# EasyEDA Pro project 3.3toTTL.eprj

# Schematic Schematic1
Create Date: 2022-09-10; Page Name: 3.3-5; Project Name: temple; Schematic Name: Schematic1; Update Date: 2022-09-11; Add into BOM: yes; Convert to PCB: yes
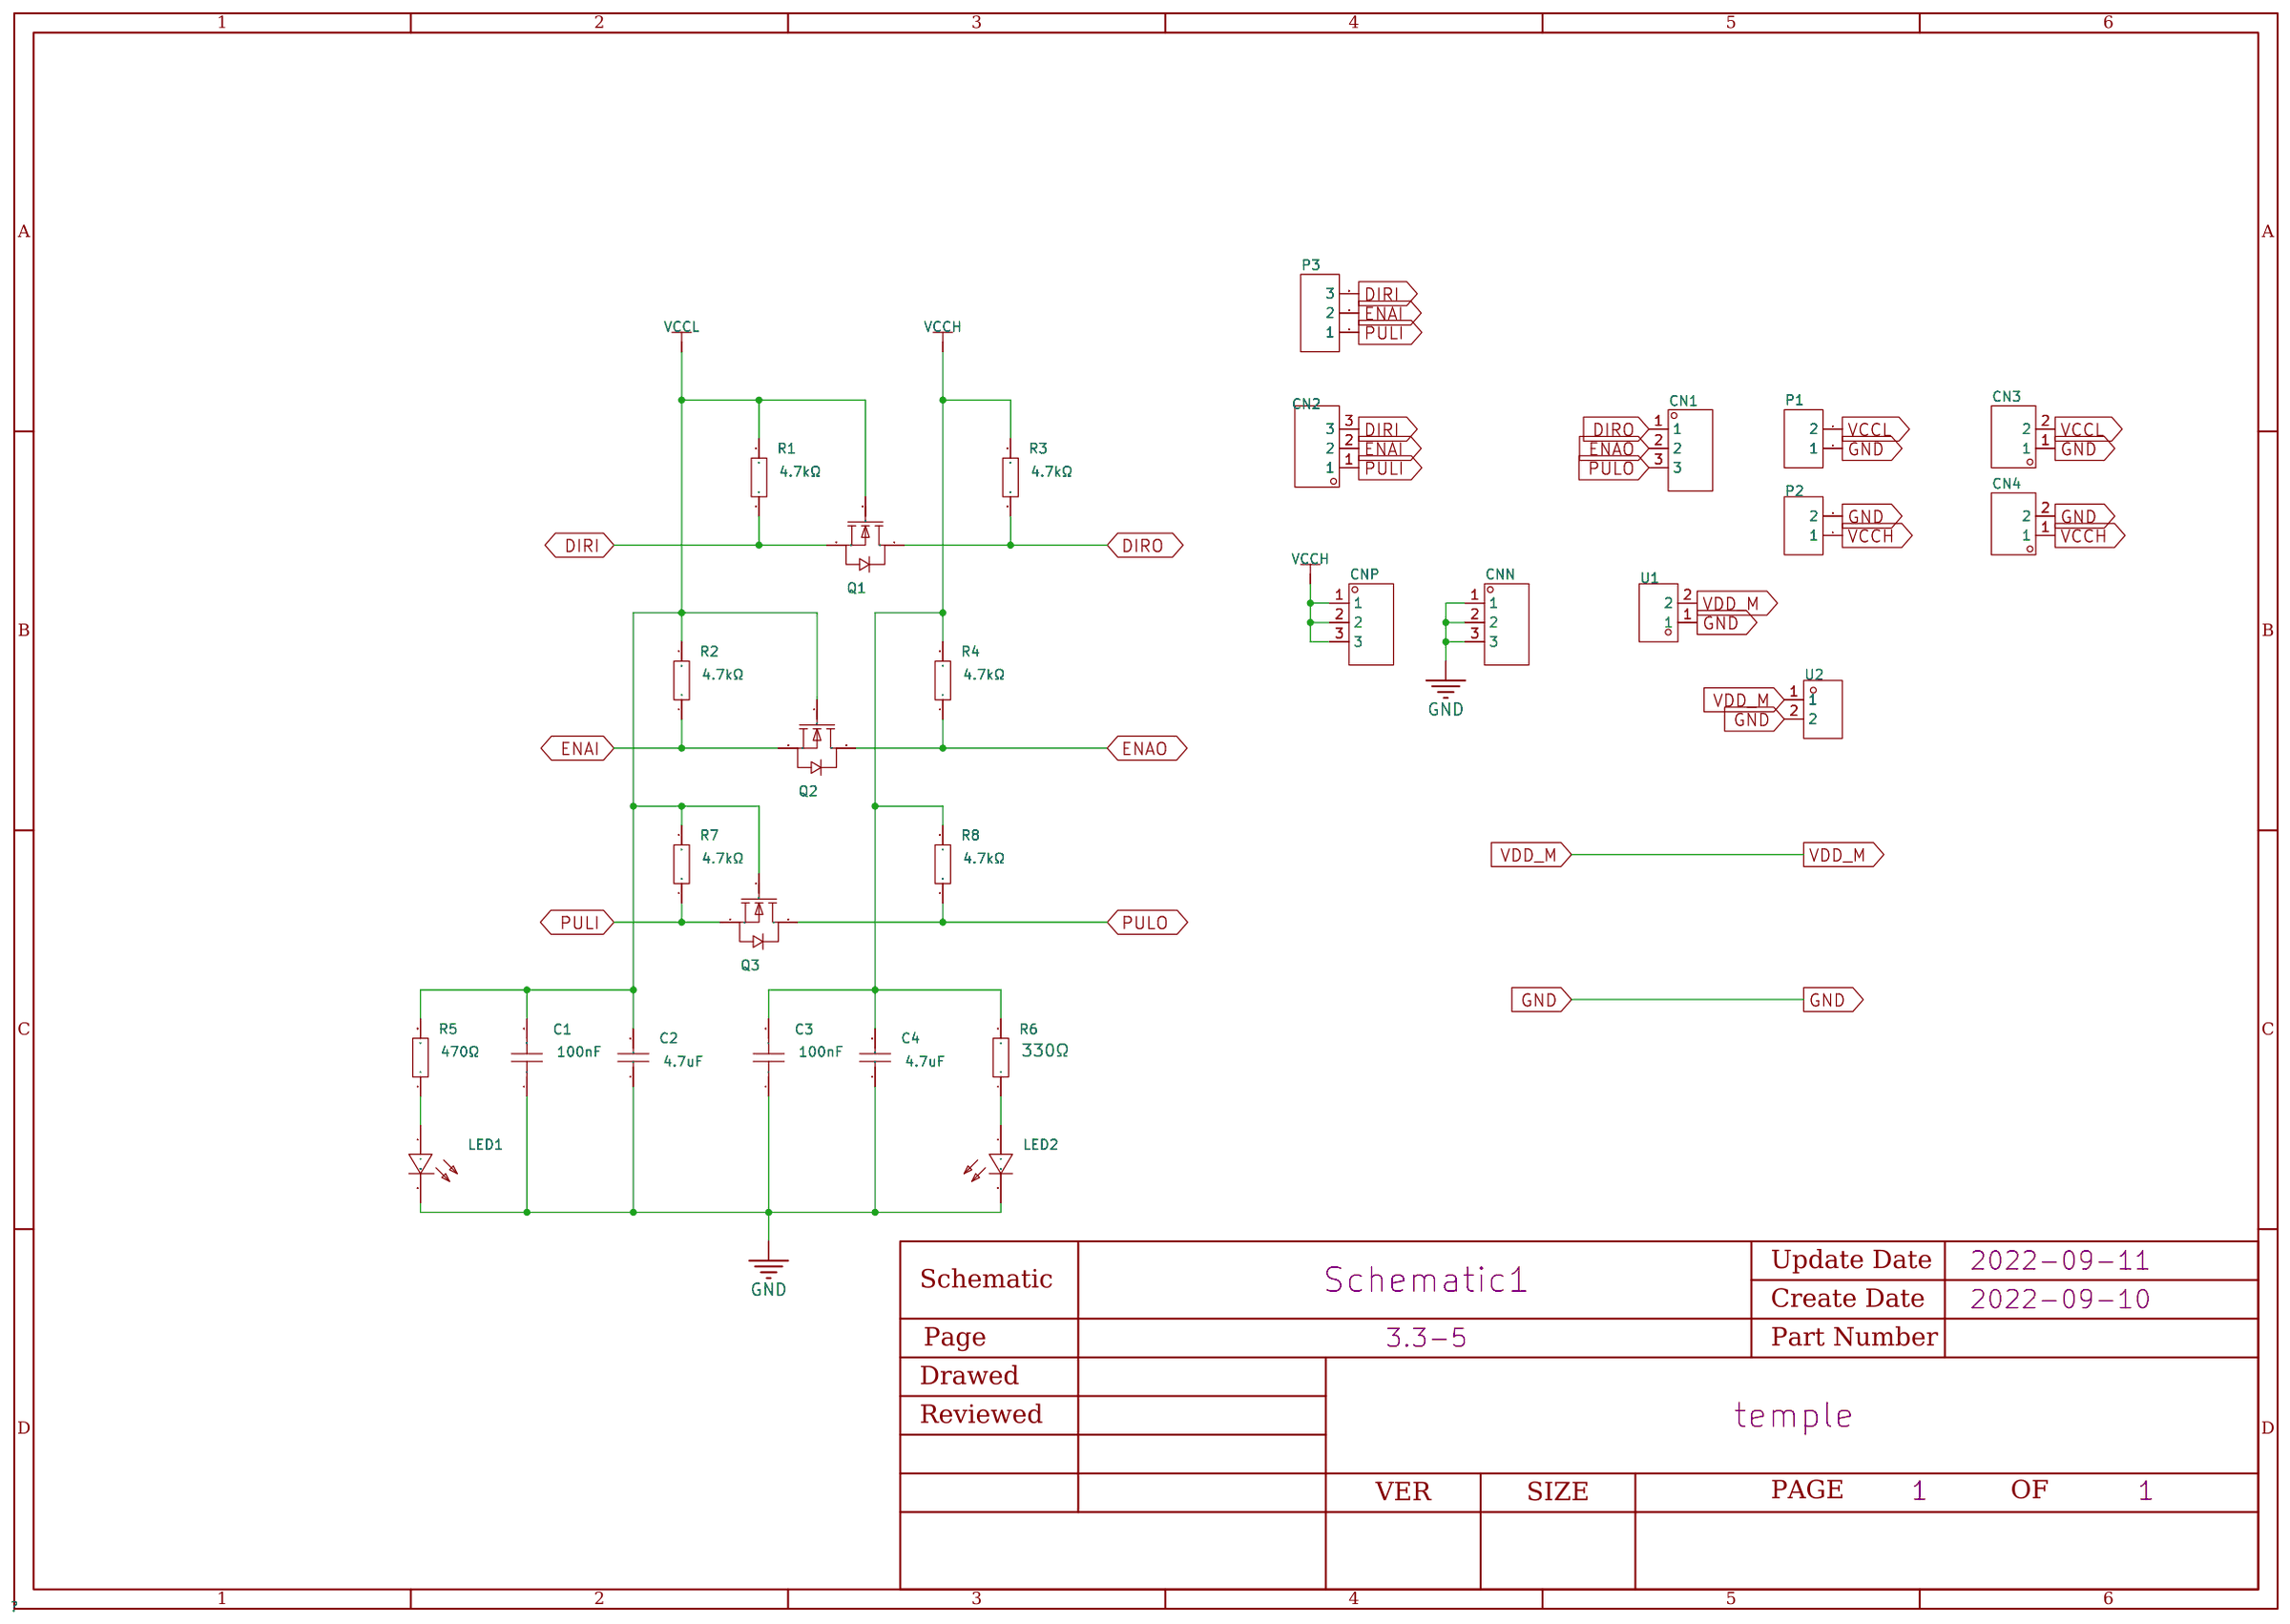
[diagram p0: schematic sheet]

## Parts
C1  100nF  [C0603]
C2  4.7uF  [C0805]
C3  100nF  [C0603]
C4  4.7uF  [C0805]
CN1  WJ15EDGVC-3.81-3P  [CONN-TH_3P-P3.81_WJ15EDGVC-3.81-3P]
CN2  WJ15EDGVC-3.81-3P  [CONN-TH_3P-P3.81_WJ15EDGVC-3.81-3P]
CN3  WJ15EDGVC-3.81-2P  [CONN-TH_WJ15EDGVC-3.81-2P]
CN4  WJ15EDGVC-3.81-2P  [CONN-TH_WJ15EDGVC-3.81-2P]
CNN  WJ15EDGVC-3.81-3P  [CONN-TH_3P-P3.81_WJ15EDGVC-3.81-3P]
CNP  WJ15EDGVC-3.81-3P  [CONN-TH_3P-P3.81_WJ15EDGVC-3.81-3P]
LED1  19-217/R6C-AL1M2VY/3T  [LED0603-R-RD]
LED2  19-217/BHC-ZL1M2RY/3T  [LED0603-R-RD_BLUE]
P1  2.54-1*2P母  [HDR-TH_2P-P2.54-V-F]
P2  2.54-1*2P母  [HDR-TH_2P-P2.54-V-F]
P3  2.54-1*3P母  [HDR-TH_3P-P2.54-V-F]
Q1  SI2302  [SOT-23-3_L2.9-W1.3-P1.90-LS2.4-BR]
Q2  SI2302  [SOT-23-3_L2.9-W1.3-P1.90-LS2.4-BR]
Q3  SI2302  [SOT-23-3_L2.9-W1.3-P1.90-LS2.4-BR]
R1  4.7kΩ  [R0402]
R2  4.7kΩ  [R0402]
R3  4.7kΩ  [R0402]
R4  4.7kΩ  [R0402]
R5  470Ω  [R1206]
R6  330Ω  [R0603]
R7  4.7kΩ  [R0402]
R8  4.7kΩ  [R0402]
U1  KF7.62-2P  [CONN-TH_KF7.62-2P]
U2  KF7.62-2P  [CONN-TH_KF7.62-2P]

## Library data of the parts
C1 C3 = CC0603KRX7R9BB104: 容值:100nF;精度:±10%;额定电压:50V;材质(温度系数):X7R;; LCSC Part Name: 100nF ±10% 50V; Supplier Part: C14663; Manufacturer: YAGEO(国巨); Supplier Footprint: 0603; JLCPCB Part Class: 基础库; Datasheet: https://atta.szlcsc.com/upload/public/pdf/source/20170116/1484561234239.pdf; Supplier: LCSC; Tolerance: ±10%; Voltage Rated: 50V; Temperature Coefficient: X7R
C2 C4 = CL21A475KBQNNNE: 容值:4.7uF;精度:±10%;额定电压:50V;材质(温度系数):X5R;; LCSC Part Name: 4.7uF ±10% 50V; Supplier Part: C98192; Manufacturer: SAMSUNG(三星); Supplier Footprint: 0805; JLCPCB Part Class: 扩展库; Datasheet: https://atta.szlcsc.com/upload/public/pdf/source/20170412/1491969149396.pdf; Supplier: LCSC; Tolerance: ±10%; Voltage Rated: 50V; Temperature Coefficient: X5R
CN1 CN2 CNN CNP = WJ15EDGVC-3.81-3P: 连接器类型:板端/插座-闭口;间距:3.81mm;排数:1;每排PIN数:3;安装方式:直针;颜色:绿色;; LCSC Part Name: 3.81mm 排数:1 每排P数:3 直针; Supplier Part: C8389; Manufacturer: KANGNEX(康奈克斯电气); Supplier Footprint: P=3.81mm; JLCPCB Part Class: 扩展库; Datasheet: https://atta.szlcsc.com/upload/public/pdf/source/20191225/C8389_B21BE5A0E910B8F69CE6926ACBB2B491.pdf; Supplier: LCSC; Connector Type: 板端/插座-闭口; Pitch: 3.81mm; Number of Rows: 1; Number of PINs Per Row: 3; Mounting Style: 直针; Color: 绿色
CN3 CN4 = WJ15EDGVC-3.81-2P: 连接器类型:板端/插座-闭口;间距:3.81mm;排数:1;每排PIN数:2;安装方式:直针;颜色:绿色;; LCSC Part Name: 3.81mm 排数:1 每排P数:2 直针; Supplier Part: C8396; Manufacturer: KANGNEX(康奈克斯电气); Supplier Footprint: P=3.81mm; JLCPCB Part Class: 扩展库; Datasheet: https://atta.szlcsc.com/upload/public/pdf/source/20191225/C8396_DFFE6D58C2AF45781C2AF0BF2B733CCC.pdf; Supplier: LCSC; Connector Type: 板端/插座-闭口; Pitch: 3.81mm; Number of Rows: 1; Number of PINs Per Row: 2; Mounting Style: 直针; Color: 绿色
LED1 = 19-217/R6C-AL1M2VY/3T: 发光颜色:红灯;二极管配置:-;透镜颜色:无色透明;主波长:617.5nm;峰值波长:632nm;色温:-;光通量(25时):-;测试电流:5mA;正向电压(VF):2.2V;发光强度:28.5mcd;功率:60mW;发光角度:120°;安装方式:-;工作温度:-40~+85;; LCSC Part Name: 红灯; Supplier Part: C72044; Manufacturer: EVERLIGHT(台湾亿光); Supplier Footprint: 0603; JLCPCB Part Class: 扩展库; Datasheet: https://atta.szlcsc.com/upload/public/pdf/source/20160507/1462613613821.pdf; Supplier: LCSC; Emitted Color: 红灯; Lens Color: 无色透明; Dominant Wavelength: 617.5nm; Peak Wavelength: 632nm; Forward Current: 5mA; Forward Voltage (VF): 2.2V; Luminous Intensity: 28.5mcd; Power Dissipation: 60mW; Viewing Angle: 120°; Operating Temperature: -40~+85
LED2 = 19-217/BHC-ZL1M2RY/3T: 照明颜色:蓝色;主波长/色坐标:465~475nm;; LCSC Part Name: 0603 蓝灯; Supplier Part: C72041; Manufacturer: EVERLIGHT(台湾亿光); Supplier Footprint: 0603; JLCPCB Part Class: 基础库; Datasheet: https://atta.szlcsc.com/upload/public/pdf/source/20170116/1484561237273.pdf; Supplier: LCSC; Mounting Type: 表面贴装; Illumination Color: 蓝色; Luminous Intensity (IF=20mA): 11.5~28.5mcd@5mA; Dominant Wavelength / Coordinate rank: 465~475nm
P1 P2 = 2.54-1*2P母: 间距:2.54mm;总孔位数:2;排数:1;插孔结构:1x2P;行距:-;安装类型:直插;塑高:-;触头材质:-;触头镀层:-;; LCSC Part Name: 2.54mm 1x2P; Supplier Part: C49661; Manufacturer: BOOMELE(博穆精密); Supplier Footprint: 直插,P=2.54mm; JLCPCB Part Class: 扩展库; Datasheet: https://atta.szlcsc.com/upload/public/pdf/source/20151109/1457707570988.pdf; Supplier: LCSC; Pitch: 2.54mm; Number of Holes: 2; Number of Rows: 1; Holes Structure: 1x2P; Mounting Type: 直插
P3 = 2.54-1*3P母: 间距:2.54mm;总孔位数:3;排数:1;行距:-;安装类型:直插;塑高:-;触头材质:-;触头镀层:金;; LCSC Part Name: 2.54mm 环保镀金; Supplier Part: C146243; Manufacturer: BOOMELE(博穆精密); Supplier Footprint: 直插,P=2.54mm; JLCPCB Part Class: 扩展库; Datasheet: https://atta.szlcsc.comnull; Supplier: LCSC; Pitch: 2.54mm; Number of Holes: 3; Number of Rows: 1; Mounting Type: 直插; Contact Plating: 金
Q1-Q3 = SI2302_C2891732: Supplier Part: C2891732; Manufacturer: YONGYUTAI(永裕泰); Supplier Footprint: SOT-23; JLCPCB Part Class: 扩展库; Datasheet: https://atta.szlcsc.com/upload/public/pdf/source/20210901/467BBA277A18343FF82D7D641AA41F7C.pdf; Supplier: LCSC
R1-R4 R7 R8 = 0402WGF4701TCE: 电阻类型:厚膜电阻;阻值:4.7kΩ;精度:±1%;功率:1/16W;温度系数:±100ppm/;最大工作电压:50V;工作温度范围:-55~+155;; LCSC Part Name: 4.7kΩ ±1% 1/16W; Supplier Part: C25900; Manufacturer: UNI-ROYAL(厚声); Supplier Footprint: 0402; JLCPCB Part Class: 基础库; Datasheet: https://atta.szlcsc.com/upload/public/pdf/source/20200306/C422600_1E6D84923E4A46A82E41ADD87F860B5C.pdf; Supplier: LCSC; Type: 厚膜电阻; Tolerance: ±1%; Power(Watts): 1/16W; Temperature Coefficient: ±100ppm/; Overload Voltage (Max): 50V; Operating Temperature Range: -55~+155
R5 = RS-06K471JT: 阻值:470Ω;精度:±5%;功率:250mW;温度系数:±100ppm/;最大工作电压:200V;工作温度范围:-55~+155;; LCSC Part Name: 470Ω ±5% 250mW; Supplier Part: C118071; Manufacturer: FH(风华); Supplier Footprint: 1206; JLCPCB Part Class: 扩展库; Datasheet: https://atta.szlcsc.com/upload/public/pdf/source/20170712/C118071_1499832438026814636.pdf; Supplier: LCSC; Tolerance: ±5%; Power(Watts): 250mW; Temperature Coefficient: ±100ppm/; Overload Voltage (Max): 200V; Operating Temperature Range: -55~+155
R6 = 0603WAF3300T5E: LCSC Part Name: 330Ω(3300) ±1% 编带; Supplier Part: C23138; Manufacturer: UNI-ROYAL(厚声); Supplier Footprint: 0603; JLCPCB Part Class: 基础库; Datasheet: https://atta.szlcsc.com/upload/public/pdf/source/20170920/C23138_1505901097035982522.pdf; Supplier: LCSC
U1 U2 = KF7.62-2P: 隔板类型:两面;间距:7.62mm;每排PIN数:2;排数:1;安装方式:直针;引脚位置:边脚;额定电流:24A;额定电压:450V;线规 - AWG:12~22;线规 - mm²:2.5;工作温度范围:-40~+105;颜色:黑色;; LCSC Part Name: 7.62mm 每排P数:2 排数:1 直针 边脚 黑色; Supplier Part: C707824; Manufacturer: KEFA(科发); Supplier Footprint: 直插,P=7.62mm; JLCPCB Part Class: 扩展库; Datasheet: https://atta.szlcsc.com/upload/public/pdf/source/20200911/C707824_085D20F539EB43FE255F4A82729CD447.pdf; Supplier: LCSC; Barrier Type: 两面; Pitch: 7.62mm; Number of PINs Per Row: 2; Number of Rows: 1; Mounting Style: 直针; Pin Location: 边脚; Current Rating (Max): 24A; Voltage Rating (Max): 450V; Wire Gauge - AWG: 12~22; Wire Gauge - mm?: 2.5; Operating Temperature Range: -40~+105; Color: 黑色

## Nets
GND: C1.1 C2.1 C3.1 C4.1 CN3.1 CN4.2 CNN.1 CNN.2 CNN.3 LED1.2(C) LED2.2(C) P1.1 P2.2 U1.1 U2.2
VCCH: C3.2 C4.2 CN4.1 CNP.1 CNP.2 CNP.3 P2.1 R3.2 R4.2 R6.2 R8.2
VCCL: C1.2 C2.2 CN3.2 P1.2 Q1.1(G) Q2.1(G) Q3.1(G) R1.2 R2.2 R5.2 R7.2
VDD_M: U1.2 U2.1
DIRI: CN2.3 P3.3 Q1.2(S) R1.1
DIRO: CN1.1 Q1.3(D) R3.1
ENAI: CN2.2 P3.2 Q2.2(S) R2.1
ENAO: CN1.2 Q2.3(D) R4.1
PULI: CN2.1 P3.1 Q3.2(S) R7.1
PULO: CN1.3 Q3.3(D) R8.1
$1N3775: LED1.1(A) R5.1
$1N4305: LED2.1(A) R6.1

# Schematic TXB
Create Date: 2022-09-17; Page Name: main; Project Name: 3.3toTTL; Schematic Name: TXB; Update Date: 2022-09-17; Company: 华南理工大学; Drawed: 林靖; Page Size: A4; Version: 2.0
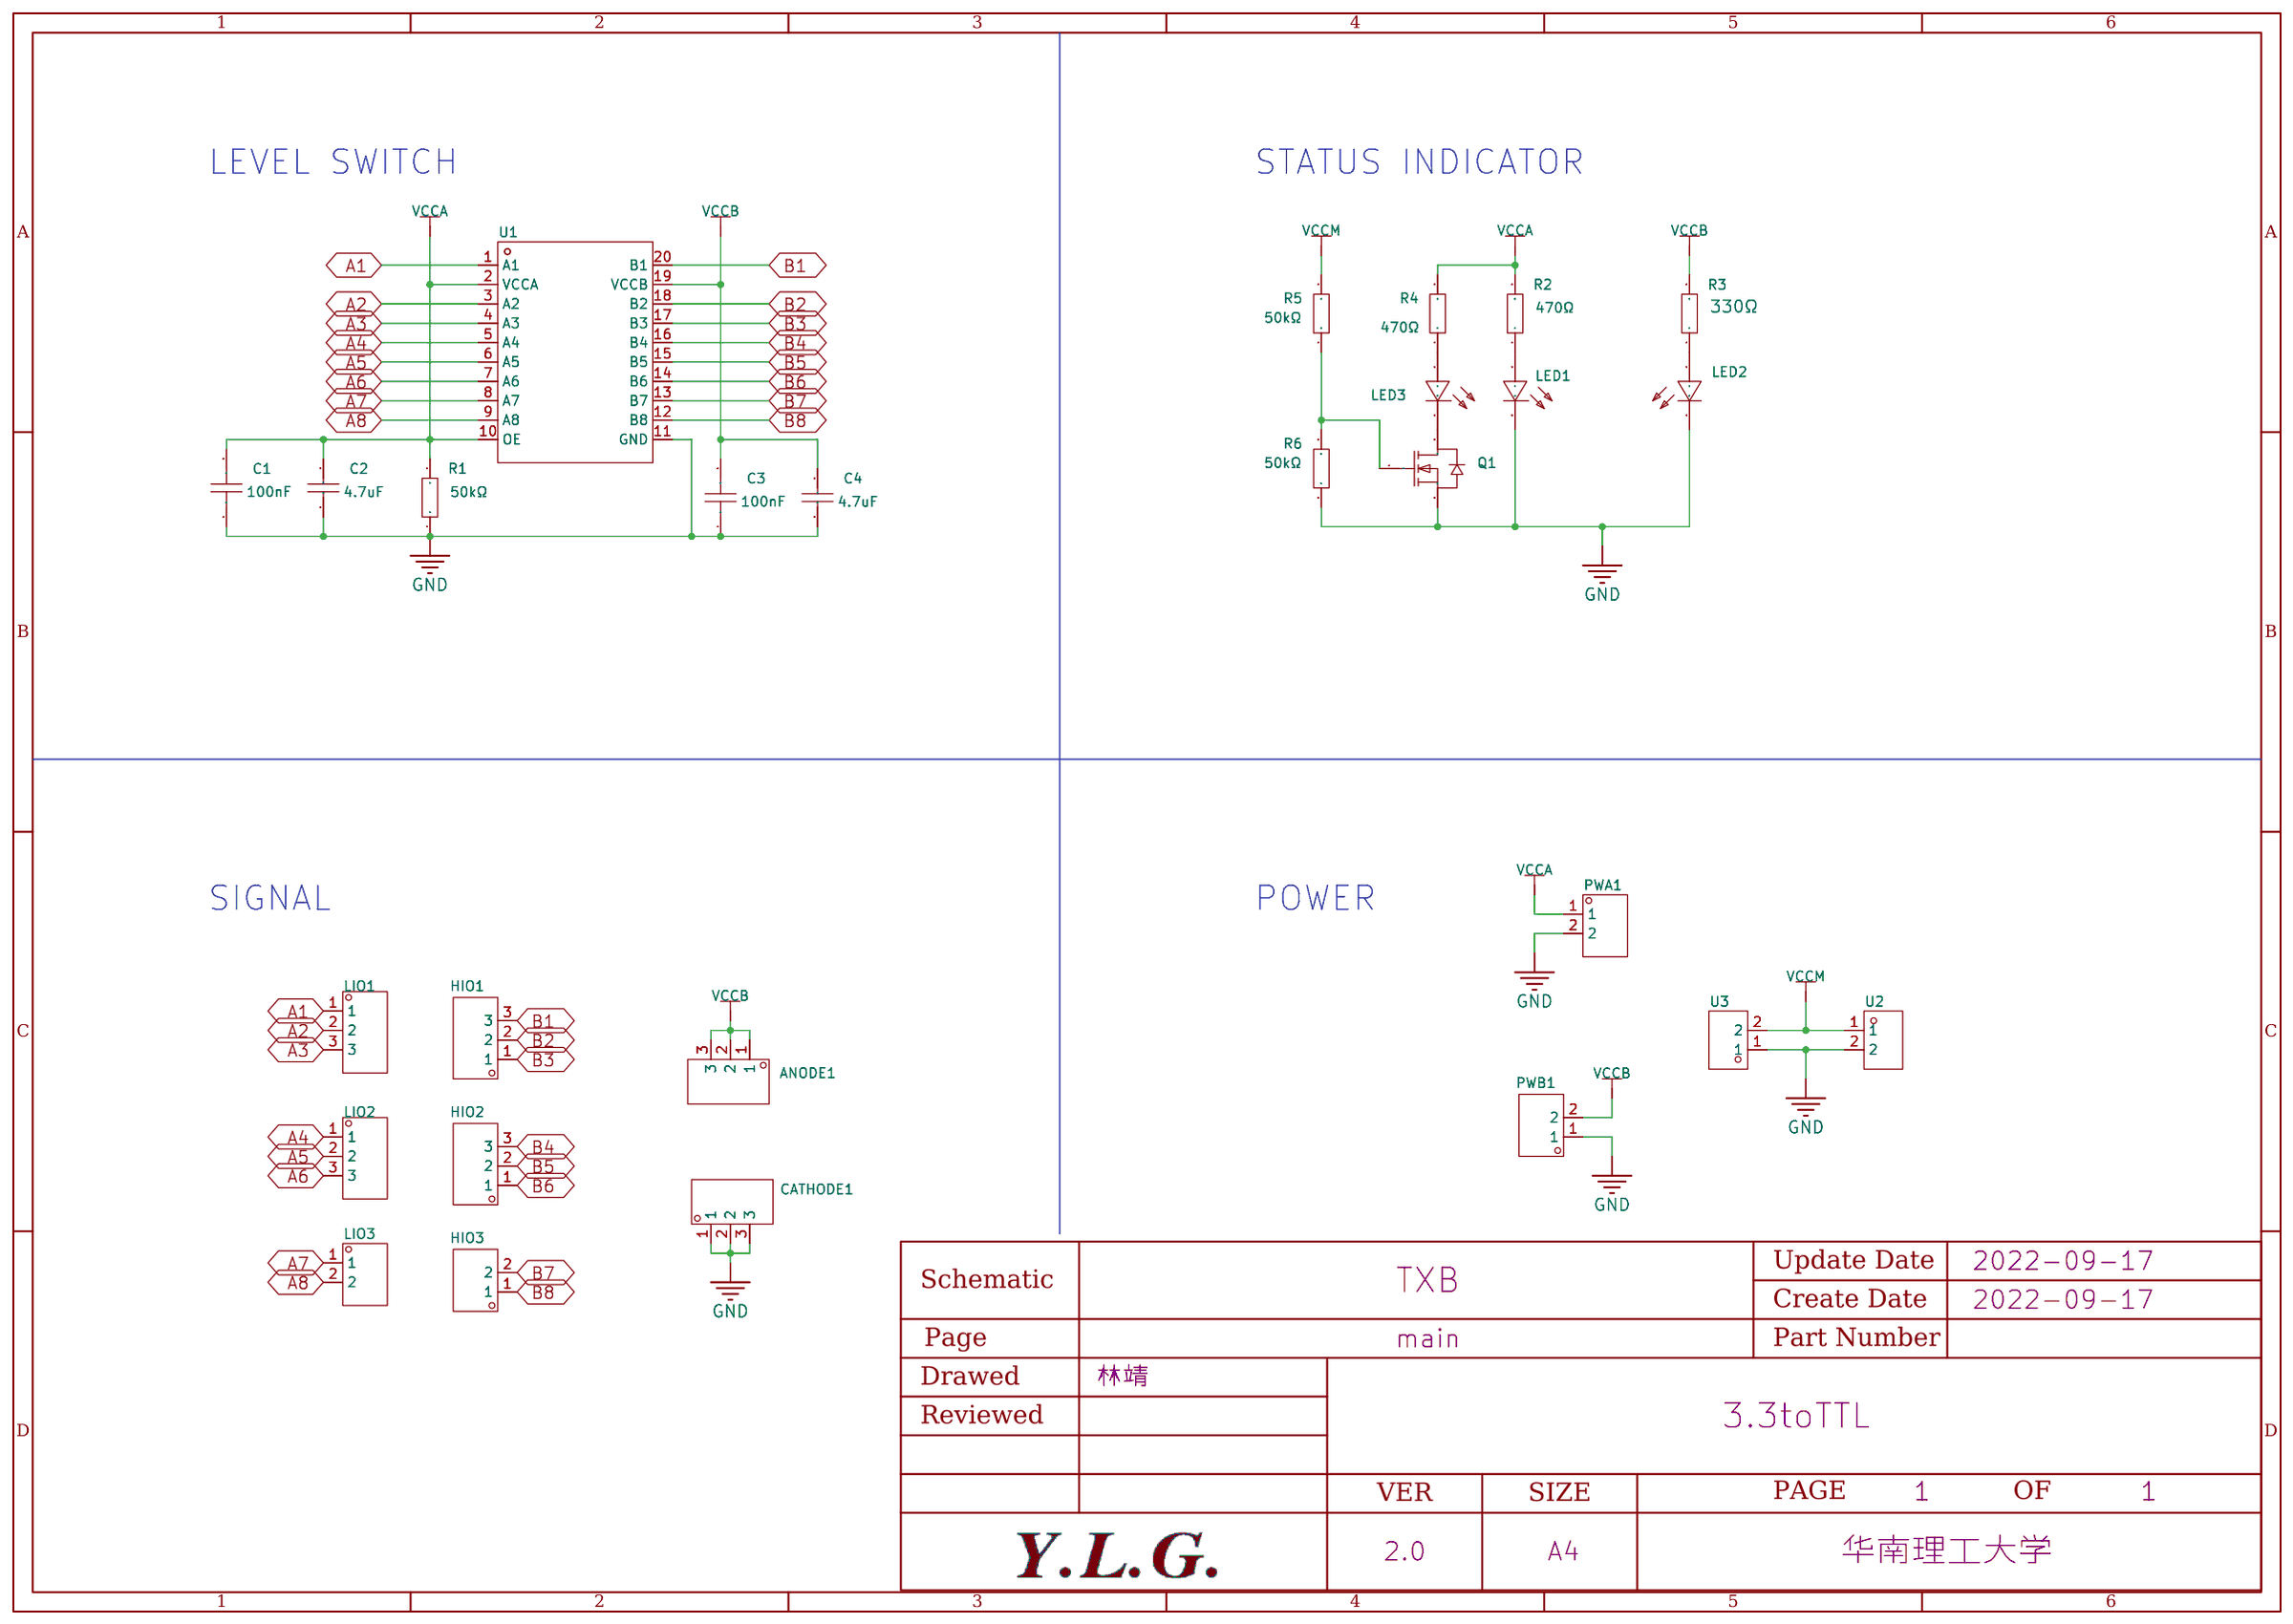
[diagram p1: schematic sheet]

## Parts
ANODE1  WJ15EDGVC-3.81-3P  [CONN-TH_3P-P3.81_WJ15EDGVC-3.81-3P]
C1  100nF  [C0603]
C2  4.7uF  [C0805]
C3  100nF  [C0603]
C4  4.7uF  [C0805]
CATHODE1  WJ15EDGVC-3.81-3P  [CONN-TH_3P-P3.81_WJ15EDGVC-3.81-3P]
HIO1  WJ15EDGVC-3.81-3P  [CONN-TH_3P-P3.81_WJ15EDGVC-3.81-3P]
HIO2  WJ15EDGVC-3.81-3P  [CONN-TH_3P-P3.81_WJ15EDGVC-3.81-3P]
HIO3  WJ15EDGVC-3.81-2P  [CONN-TH_WJ15EDGVC-3.81-2P]
LED1  19-217/R6C-AL1M2VY/3T  [LED0603-R-RD]
LED2  19-217/BHC-ZL1M2RY/3T  [LED0603-R-RD_BLUE]
LED3  19-217/R6C-AL1M2VY/3T  [LED0603-R-RD]
LIO1  WJ15EDGVC-3.81-3P  [CONN-TH_3P-P3.81_WJ15EDGVC-3.81-3P]
LIO2  WJ15EDGVC-3.81-3P  [CONN-TH_3P-P3.81_WJ15EDGVC-3.81-3P]
LIO3  WJ15EDGVC-3.81-2P  [CONN-TH_WJ15EDGVC-3.81-2P]
PWA1  WJ15EDGVC-3.81-2P  [CONN-TH_WJ15EDGVC-3.81-2P]
PWB1  WJ15EDGVC-3.81-2P  [CONN-TH_WJ15EDGVC-3.81-2P]
Q1  2N7002  [SOT-23-3_L2.9-W1.3-P1.90-LS2.4-BR]
R1  50kΩ  [R0805]
R2  470Ω  [R1206]
R3  330Ω  [R0603]
R4  470Ω  [R1206]
R5  50kΩ  [R0805]
R6  50kΩ  [R0805]
U1  TXB0108PWR  [TSSOP-20_L6.5-W4.4-P0.65-LS6.4-BL]
U2  KF7.62-2P  [CONN-TH_KF7.62-2P]
U3  KF7.62-2P  [CONN-TH_KF7.62-2P]

## Library data of the parts
ANODE1 CATHODE1 HIO1 HIO2 LIO1 LIO2 = WJ15EDGVC-3.81-3P: 连接器类型:板端/插座-闭口;间距:3.81mm;排数:1;每排PIN数:3;安装方式:直针;颜色:绿色;; LCSC Part Name: 3.81mm 排数:1 每排P数:3 直针; Supplier Part: C8389; Manufacturer: KANGNEX(康奈克斯电气); Supplier Footprint: P=3.81mm; JLCPCB Part Class: 扩展库; Datasheet: https://atta.szlcsc.com/upload/public/pdf/source/20191225/C8389_B21BE5A0E910B8F69CE6926ACBB2B491.pdf; Supplier: LCSC; Connector Type: 板端/插座-闭口; Pitch: 3.81mm; Number of Rows: 1; Number of PINs Per Row: 3; Mounting Style: 直针; Color: 绿色
C1 C3 = CC0603KRX7R9BB104: 容值:100nF;精度:±10%;额定电压:50V;材质(温度系数):X7R;; LCSC Part Name: 100nF ±10% 50V; Supplier Part: C14663; Manufacturer: YAGEO(国巨); Supplier Footprint: 0603; JLCPCB Part Class: 基础库; Datasheet: https://atta.szlcsc.com/upload/public/pdf/source/20170116/1484561234239.pdf; Supplier: LCSC; Tolerance: ±10%; Voltage Rated: 50V; Temperature Coefficient: X7R
C2 C4 = CL21A475KBQNNNE: 容值:4.7uF;精度:±10%;额定电压:50V;材质(温度系数):X5R;; LCSC Part Name: 4.7uF ±10% 50V; Supplier Part: C98192; Manufacturer: SAMSUNG(三星); Supplier Footprint: 0805; JLCPCB Part Class: 扩展库; Datasheet: https://atta.szlcsc.com/upload/public/pdf/source/20170412/1491969149396.pdf; Supplier: LCSC; Tolerance: ±10%; Voltage Rated: 50V; Temperature Coefficient: X5R
HIO3 LIO3 PWA1 PWB1 = WJ15EDGVC-3.81-2P: 连接器类型:板端/插座-闭口;间距:3.81mm;排数:1;每排PIN数:2;安装方式:直针;颜色:绿色;; LCSC Part Name: 3.81mm 排数:1 每排P数:2 直针; Supplier Part: C8396; Manufacturer: KANGNEX(康奈克斯电气); Supplier Footprint: P=3.81mm; JLCPCB Part Class: 扩展库; Datasheet: https://atta.szlcsc.com/upload/public/pdf/source/20191225/C8396_DFFE6D58C2AF45781C2AF0BF2B733CCC.pdf; Supplier: LCSC; Connector Type: 板端/插座-闭口; Pitch: 3.81mm; Number of Rows: 1; Number of PINs Per Row: 2; Mounting Style: 直针; Color: 绿色
LED1 LED3 = 19-217/R6C-AL1M2VY/3T: 发光颜色:红灯;二极管配置:-;透镜颜色:无色透明;主波长:617.5nm;峰值波长:632nm;色温:-;光通量(25时):-;测试电流:5mA;正向电压(VF):2.2V;发光强度:28.5mcd;功率:60mW;发光角度:120°;安装方式:-;工作温度:-40~+85;; LCSC Part Name: 红灯; Supplier Part: C72044; Manufacturer: EVERLIGHT(台湾亿光); Supplier Footprint: 0603; JLCPCB Part Class: 扩展库; Datasheet: https://atta.szlcsc.com/upload/public/pdf/source/20160507/1462613613821.pdf; Supplier: LCSC; Emitted Color: 红灯; Lens Color: 无色透明; Dominant Wavelength: 617.5nm; Peak Wavelength: 632nm; Forward Current: 5mA; Forward Voltage (VF): 2.2V; Luminous Intensity: 28.5mcd; Power Dissipation: 60mW; Viewing Angle: 120°; Operating Temperature: -40~+85
LED2 = 19-217/BHC-ZL1M2RY/3T: 照明颜色:蓝色;主波长/色坐标:465~475nm;; LCSC Part Name: 0603 蓝灯; Supplier Part: C72041; Manufacturer: EVERLIGHT(台湾亿光); Supplier Footprint: 0603; JLCPCB Part Class: 基础库; Datasheet: https://atta.szlcsc.com/upload/public/pdf/source/20170116/1484561237273.pdf; Supplier: LCSC; Mounting Type: 表面贴装; Illumination Color: 蓝色; Luminous Intensity (IF=20mA): 11.5~28.5mcd@5mA; Dominant Wavelength / Coordinate rank: 465~475nm
Q1 = 2N7002: 类型:N沟道;漏源电压(Vdss):60V;连续漏极电流(Id):115mA;功率(Pd):200mW;导通电阻(RDS(on)@Vgs,Id):7.5Ω@10V,500mA;阈值电压(Vgs(th)@Id):2.5V@250A;; LCSC Part Name: N沟道 60V 115mA; Supplier Part: C8545; Manufacturer: CJ（江苏长电/长晶）; Supplier Footprint: SOT-23(SOT-23-3); JLCPCB Part Class: 基础库; Datasheet: https://atta.szlcsc.com/upload/public/pdf/source/20170302/1488422688078.pdf; Supplier: LCSC; Type: N沟道; Drain Source Voltage (Vdss): 60V; Continuous Drain Current (Id): 115mA; Power Dissipation (Pd): 200mW; Drain Source On Resistance (RDS(on)@Vgs,Id): 7.5Ω@10V,500mA; Gate Threshold Voltage (Vgs(th)@Id): 2.5V@250A
R1 R5 R6 = AR05BTCW5002: 电阻类型:薄膜电阻;阻值:50kΩ;精度:±0.1%;功率:125mW;温度系数:±25ppm/;最大工作电压:100V;工作温度范围:-55~+155;; LCSC Part Name: 50kΩ ±0.1% 125mW; Supplier Part: C316211; Manufacturer: Viking(光颉); Supplier Footprint: 0805; JLCPCB Part Class: 扩展库; Datasheet: https://atta.szlcsc.com/upload/public/pdf/source/20181023/C316211_5E3B1DD8AC66E60BF05A8B1CCEE8EB5B.pdf; Supplier: LCSC; Type: 薄膜电阻; Tolerance: ±0.1%; Power(Watts): 125mW; Temperature Coefficient: ±25ppm/; Overload Voltage (Max): 100V; Operating Temperature Range: -55~+155
R2 R4 = RS-06K471JT: 阻值:470Ω;精度:±5%;功率:250mW;温度系数:±100ppm/;最大工作电压:200V;工作温度范围:-55~+155;; LCSC Part Name: 470Ω ±5% 250mW; Supplier Part: C118071; Manufacturer: FH(风华); Supplier Footprint: 1206; JLCPCB Part Class: 扩展库; Datasheet: https://atta.szlcsc.com/upload/public/pdf/source/20170712/C118071_1499832438026814636.pdf; Supplier: LCSC; Tolerance: ±5%; Power(Watts): 250mW; Temperature Coefficient: ±100ppm/; Overload Voltage (Max): 200V; Operating Temperature Range: -55~+155
R3 = 0603WAF3300T5E: LCSC Part Name: 330Ω(3300) ±1% 编带; Supplier Part: C23138; Manufacturer: UNI-ROYAL(厚声); Supplier Footprint: 0603; JLCPCB Part Class: 基础库; Datasheet: https://atta.szlcsc.com/upload/public/pdf/source/20170920/C23138_1505901097035982522.pdf; Supplier: LCSC
U1 = TXB0108PWR: 转换器类型:电压电平;通道类型:双向;电路数:1;每个电路通道数:8;工作电压(VCCA):1.2V~3.6V;工作电压(VCCB):1.65V~5.5V;输入信号:-;输出信号:-;输出类型:三态，非反相;数据速率:100Mbps;工作温度:-40~+85;特性:自动方向检测;; Supplier Part: C53406; Manufacturer: TI(德州仪器); Supplier Footprint: TSSOP-20; JLCPCB Part Class: 扩展库; Datasheet: https://atta.szlcsc.com/upload/public/pdf/source/20150713/1457707329879.pdf; Supplier: LCSC; Translator Type: 电压电平; Channel Type: 双向; Number of Circuits: 1; Channels per Circuit: 8; Supply Voltage (VCCA): 1.2V~3.6V; Supply Voltage (VCCB): 1.65V~5.5V; Output Type: 三态，非反相; Data Rate: 100Mbps; Operating Temperature: -40~+85; Features: 自动方向检测
U2 U3 = KF7.62-2P: 隔板类型:两面;间距:7.62mm;每排PIN数:2;排数:1;安装方式:直针;引脚位置:边脚;额定电流:24A;额定电压:450V;线规 - AWG:12~22;线规 - mm²:2.5;工作温度范围:-40~+105;颜色:黑色;; LCSC Part Name: 7.62mm 每排P数:2 排数:1 直针 边脚 黑色; Supplier Part: C707824; Manufacturer: KEFA(科发); Supplier Footprint: 直插,P=7.62mm; JLCPCB Part Class: 扩展库; Datasheet: https://atta.szlcsc.com/upload/public/pdf/source/20200911/C707824_085D20F539EB43FE255F4A82729CD447.pdf; Supplier: LCSC; Barrier Type: 两面; Pitch: 7.62mm; Number of PINs Per Row: 2; Number of Rows: 1; Mounting Style: 直针; Pin Location: 边脚; Current Rating (Max): 24A; Voltage Rating (Max): 450V; Wire Gauge - AWG: 12~22; Wire Gauge - mm?: 2.5; Operating Temperature Range: -40~+105; Color: 黑色

## Nets
GND: C1.1 C2.1 C3.1 C4.1 CATHODE1.1 CATHODE1.2 CATHODE1.3 LED1.2(C) LED2.2(C) PWA1.2 PWB1.1 Q1.2(S) R1.1 R6.1 U1.11(GND) U2.2 U3.1
VCCA: C1.2 C2.2 PWA1.1 R1.2 R2.2 R4.2 U1.2(VCCA) U1.10(OE)
VCCB: ANODE1.1 ANODE1.2 ANODE1.3 C3.2 C4.2 PWB1.2 R3.2 U1.19(VCCB)
VCCM: R5.2 U2.1 U3.2
A1: LIO1.1 U1.1(A1)
A2: LIO1.2 U1.3(A2)
A3: LIO1.3 U1.4(A3)
A4: LIO2.1 U1.5(A4)
A5: LIO2.2 U1.6(A5)
A6: LIO2.3 U1.7(A6)
A7: LIO3.1 U1.8(A7)
A8: LIO3.2 U1.9(A8)
B1: HIO1.3 U1.20(B1)
B2: HIO1.2 U1.18(B2)
B3: HIO1.1 U1.17(B3)
B4: HIO2.3 U1.16(B4)
B5: HIO2.2 U1.15(B5)
B6: HIO2.1 U1.14(B6)
B7: HIO3.2 U1.13(B7)
B8: HIO3.1 U1.12(B8)
$1N1712: LED1.1(A) R2.1
$1N1958: LED2.1(A) R3.1
$1N11307: LED3.1(A) R4.1
$1N13493: LED3.2(C) Q1.3(D)
$1N13938: Q1.1(G) R5.1 R6.2

## Notes on the sheet
- LEVEL SWITCH
- STATUS INDICATOR
- SIGNAL
- POWER

# Board PCB1
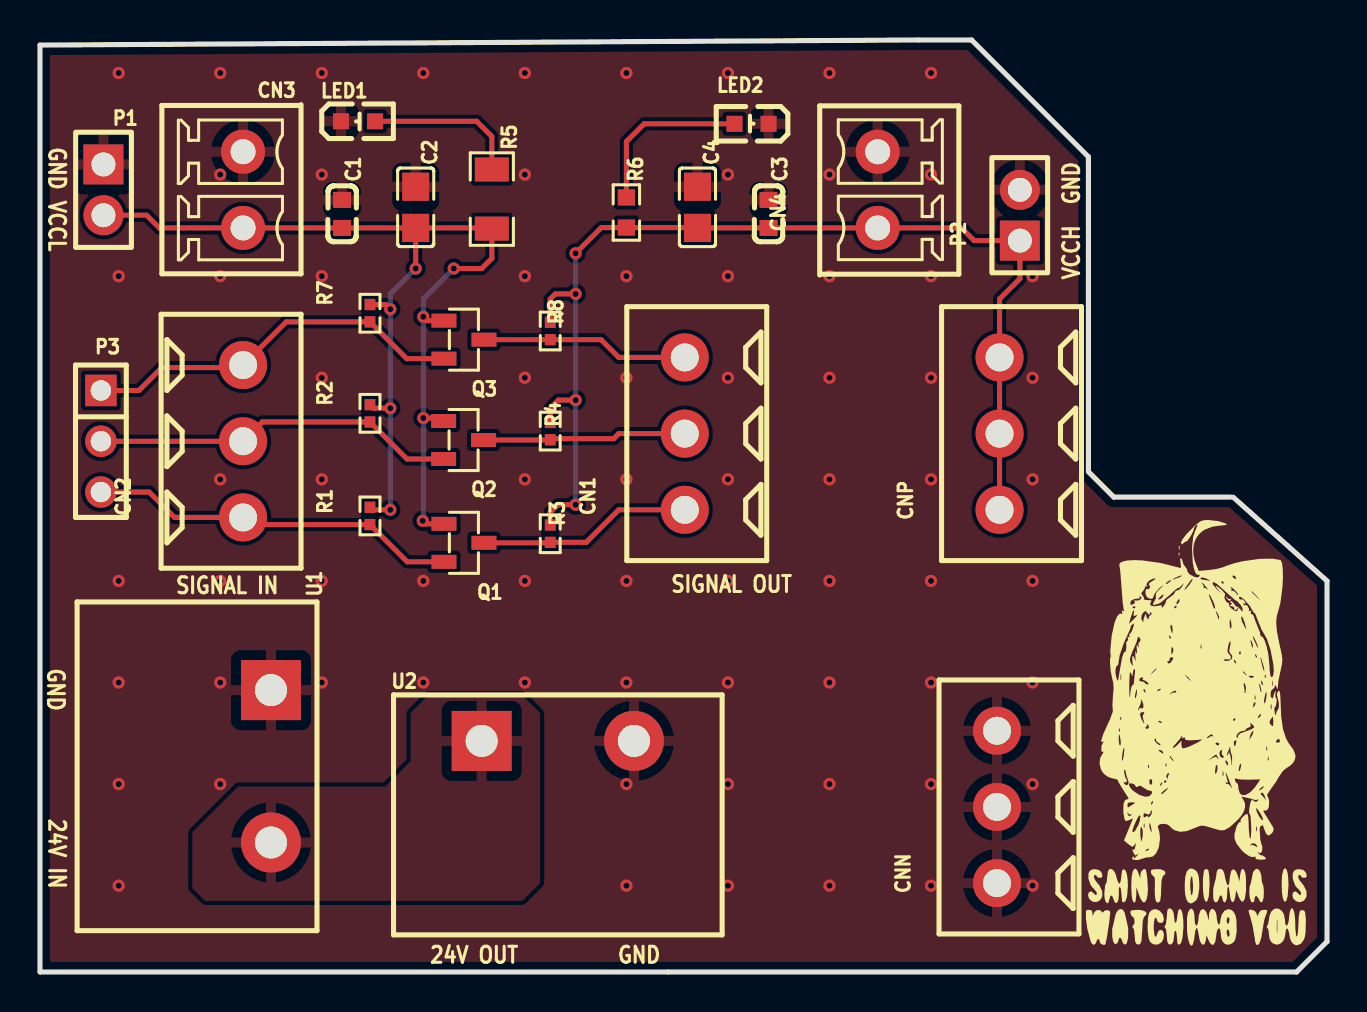
[diagram p2: board, top side]
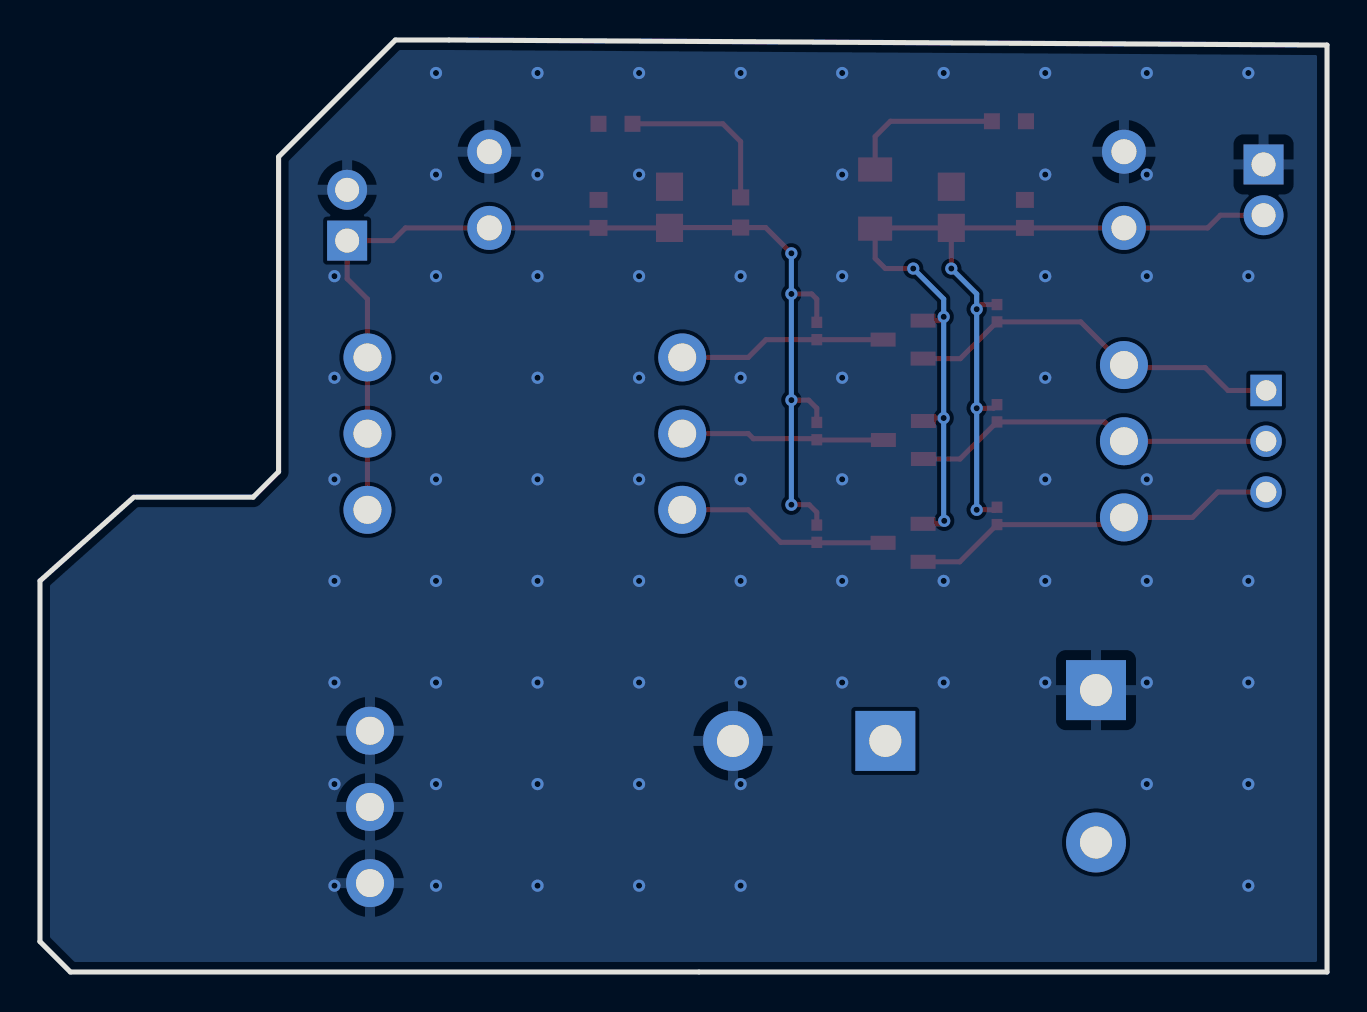
[diagram p3: board, bottom side, seen from below]

Outline 64.39 x 46.61 mm; copper layers: Top Layer, Bottom Layer. Coordinates in mm from the lower left corner of the outline.
Outline path: 59.56,23.75 53.72,23.75 52.45,25.02 52.45,40.77 46.61,46.61 43.94,46.61 0,46.36 0,0 62.87,0 64.39,1.52 64.39,19.56 59.69,23.75
Stack: Top Layer 0.035mm / Dielectric1 1.51mm FR4 er 4.5 / Bottom Layer 0.035mm

## Design rules (mm)
spacing safeClearance (default): track to track 0.152, other pairs 0.152 to 0.3
track width trackWidth (default): min 0.127, default 0.254, max 2.54
differential pair differentialPair (default): width min 0.127, default 0.254, max 2.54; gap min 0.152, default 0.152
via viaSize (default): diameter min 0.5, default 0.61, max 10; hole min 0.3, default 0.305, max 6

## Placement (name value [footprint] x y rotation side)
C1  100nF  [C0603]  15.11 37.91 270 top
C2  4.7uF  [C0805]  18.8 38.24 270 top
C3  100nF  [C0603]  36.45 37.91 270 top
C4  4.7uF  [C0805]  32.89 38.24 270 top
CN1  WJ15EDGVC-3.81-3P  [CONN-TH_3P-P3.81_WJ15EDGVC-3.81-3P]  32.26 26.92 90 top
CN2  WJ15EDGVC-3.81-3P  [CONN-TH_3P-P3.81_WJ15EDGVC-3.81-3P]  10.16 26.54 270 top
CN3  WJ15EDGVC-3.81-2P  [CONN-TH_WJ15EDGVC-3.81-2P]  10.16 39.12 270 top
CN4  WJ15EDGVC-3.81-2P  [CONN-TH_WJ15EDGVC-3.81-2P]  41.91 39.12 90 top
CNN  WJ15EDGVC-3.81-3P  [CONN-TH_3P-P3.81_WJ15EDGVC-3.81-3P]  47.88 8.26 90 top
CNP  WJ15EDGVC-3.81-3P  [CONN-TH_3P-P3.81_WJ15EDGVC-3.81-3P]  48.01 26.92 90 top
LED1  19-217/R6C-AL1M2VY/3T  [LED0603-R-RD]  15.91 42.55 0 top
LED2  19-217/BHC-ZL1M2RY/3T  [LED0603-R-RD_BLUE]  35.6 42.42 180 top
P1  2.54-1*2P母  [HDR-TH_2P-P2.54-V-F]  3.17 39.12 270 top
P2  2.54-1*2P母  [HDR-TH_2P-P2.54-V-F]  49.02 37.85 90 top
P3  2.54-1*3P母  [HDR-TH_3P-P2.54-V-F]  3.05 26.54 270 top
Q1  SI2302  [SOT-23-3_L2.9-W1.3-P1.90-LS2.4-BR]  21.21 21.46 180 top
Q2  SI2302  [SOT-23-3_L2.9-W1.3-P1.90-LS2.4-BR]  21.19 26.6 180 top
Q3  SI2302  [SOT-23-3_L2.9-W1.3-P1.90-LS2.4-BR]  21.21 31.62 180 top
R1  4.7kΩ  [R0402]  16.51 22.81 90 top
R2  4.7kΩ  [R0402]  16.51 27.94 90 top
R3  4.7kΩ  [R0402]  25.53 21.92 90 top
R4  4.7kΩ  [R0402]  25.53 27.05 90 top
R5  470Ω  [R1206]  22.61 38.65 270 top
R6  330Ω  [R0603]  29.34 37.98 270 top
R7  4.7kΩ  [R0402]  16.51 32.95 90 top
R8  4.7kΩ  [R0402]  25.53 32.06 90 top
U1  KF7.62-2P  [CONN-TH_KF7.62-2P]  11.56 10.29 270 top
U2  KF7.62-2P  [CONN-TH_KF7.62-2P]  25.91 11.56 0 top

## Footprints (pads in the part's own frame, mm; a bottom-side part is the same pattern mirrored in y, then rotated)
C0603
  rect 0.8x0.9 smd: 1(-0.7,0) 2(0.7,0)
C0805
  rect 1.41x1.35 smd: 1(-1.03,0) 2(1.03,0)
CONN-TH_3P-P3.81_WJ15EDGVC-3.81-3P
  round 2.401 hole 1.399: 1(-3.81,0) 2(0,0) 3(3.81,0)
CONN-TH_KF7.62-2P
  rect 2.999x2.999 hole 1.6: 1(-3.81,0)
  round 2.999 hole 1.6: 2(3.81,0)
CONN-TH_WJ15EDGVC-3.81-2P
  round 2.2 hole 1.25: 1(-1.905,0) 2(1.905,0)
HDR-TH_2P-P2.54-V-F
  rect 1.999x1.999 hole 1.199: 1(-1.27,0)
  round 1.999 hole 1.199: 2(1.27,0)
HDR-TH_3P-P2.54-V-F
  rect 1.575x1.575 hole 1.02: 1(-2.54,0)
  round 1.575 hole 1.02: 2(0,0) 3(2.54,0)
LED0603-R-RD
  rect 0.8x0.8 smd: 1(0.851,0) 2(-0.851,0)
LED0603-R-RD_BLUE
  rect 0.8x0.8 smd: 1(0.851,0) 2(-0.851,0)
R0402
  rect 0.566x0.54 smd: 1(-0.433,0) 2(0.433,0)
R0603
  rect 0.806x0.864 smd: 1(-0.753,0) 2(0.753,0)
R1206
  rect 1.208x1.701 smd: 1(-1.479,0) 2(1.479,0)
SOT-23-3_L2.9-W1.3-P1.90-LS2.4-BR
  rect 1.25x0.7 smd: 1(1,-0.95) 2(1,0.95) 3(-1,0)

## Nets
As in the schematic.

## Via types
v1: diameter 0.61, hole 0.305, Top Layer to Bottom Layer, 84 vias

## Routing (per net, layer and track width the routed paths; a pad name or vN(x,y) marks a point on that pad's centre or on a via; arc(x,y) is an arc through that point)
GND:
  vias: v1(3.94,44.96) v1(3.94,34.8) v1(3.94,19.56) v1(3.94,14.48) v1(3.94,9.4) v1(3.94,4.32) v1(9.02,44.96) v1(9.02,39.88) v1(9.02,34.8) v1(9.02,24.64) v1(9.02,19.56) v1(9.02,14.48) v1(9.02,9.4) v1(14.1,44.96) v1(14.1,39.88) v1(14.1,34.8) v1(14.1,29.72) v1(14.1,24.64) v1(14.1,19.56) v1(14.1,14.48) v1(19.18,44.96) v1(19.18,19.56) v1(19.18,14.48) v1(24.26,44.96) v1(24.26,39.88) v1(24.26,34.8) v1(24.26,29.72) v1(24.26,24.64) v1(24.26,19.56) v1(24.26,14.48) v1(29.34,44.96) v1(29.34,34.8) v1(29.34,29.72) v1(29.34,24.64) v1(29.34,19.56) v1(29.34,14.48) v1(29.34,9.4) v1(29.34,4.32) v1(34.42,44.96) v1(34.42,39.88) v1(34.42,34.8) v1(34.42,29.72) v1(34.42,24.64) v1(34.42,19.56) v1(34.42,14.48) v1(34.42,9.4) v1(34.42,4.32) v1(39.5,44.96) v1(39.5,39.88) v1(39.5,34.8) v1(39.5,29.72) v1(39.5,24.64) v1(39.5,19.56) v1(39.5,14.48) v1(39.5,9.4) v1(39.5,4.32) v1(44.58,44.96) v1(44.58,39.88) v1(44.58,34.8) v1(44.58,29.72) v1(44.58,24.64) v1(44.58,19.56) v1(44.58,14.48) v1(44.58,9.4) v1(44.58,4.32) v1(49.66,34.8) v1(49.66,29.72) v1(49.66,24.64) v1(49.66,19.56) v1(49.66,14.48) v1(49.66,9.4) v1(49.66,4.32)
VCCH: length 56.2
  Top Layer w0.254: v1(26.8,23.37) 25.91,23.37 25.53,22.99 R3.2 ; CNP.1 CNP.2 CNP.3 48.01,33.66 49.02,34.67 P2.1 46.74,36.58 46.1,37.21 CN4.1 C3.2 C4.2 32.88,37.23 28.08,37.23 v1(26.8,35.94) ; R4.2 25.53,28.19 25.93,28.6 v1(26.8,28.6) ; R8.2 25.53,33.66 25.78,33.91 v1(26.8,33.91)
  Bottom Layer w0.254: v1(26.8,23.37) v1(26.8,28.6) v1(26.8,33.91) v1(26.8,35.94)
VCCL: length 57.8
  Top Layer w0.254: 16.51,33.38 17.3,33.38 v1(17.53,33.15) ; C2.2 22.57,37.21 R5.2 22.61,35.69 22.1,35.18 v1(20.7,35.18) ; C2.2 C1.2 CN3.2 5.97,37.21 5.33,37.85 P1.2 ; C2.2 v1(18.8,35.18) ; v1(19.15,22.56) 19.3,22.41 Q1.1 ; v1(17.53,23.11) 16.64,23.11 R1.2 ; v1(19.18,27.7) 20.04,27.7 Q2.1 ; Q3.1 19.37,32.57 v1(19.18,32.77) ; R2.2 16.69,28.19 v1(17.53,28.19)
  Bottom Layer w0.254: v1(19.15,22.56) 19.18,22.59 v1(19.18,27.7) 19.18,27.71 v1(19.18,32.77) 19.18,33.66 v1(20.7,35.18) ; v1(17.53,23.11) v1(17.53,28.19) v1(17.53,33.15) 17.53,33.91 v1(18.8,35.18)
DIRI: length 18.6
  Top Layer w0.254: Q1.2 18.37,20.51 R1.1 10.52,22.38 CN2.3 6.73,22.73 5.46,24 P3.3
DIRO: length 10.7
  Top Layer w0.254: Q1.3 25.5,21.46 25.53,21.49 27.33,21.49 28.96,23.11 CN1.1
ENAI: length 18.3
  Top Layer w0.254: Q2.2 18.36,25.65 R2.1 11.12,27.51 CN2.2 P3.2
ENAO: length 10.2
  Top Layer w0.254: Q2.3 25.51,26.6 25.58,26.67 28.7,26.67 28.96,26.92 CN1.2
PULI: length 19.3
  Top Layer w0.254: P3.1 4.95,29.08 6.1,30.23 10.03,30.23 CN2.1 12.32,32.51 R7.1 18.35,30.67 Q3.2
PULO: length 10.4
  Top Layer w0.254: CN1.3 28.96,30.73 28.07,31.62 R8.1 Q3.3
$1N3775: length 7.8
  Top Layer w0.254: LED1.1 21.84,42.55 22.61,41.78 R5.1
$1N4305: length 8.6
  Top Layer w0.254: LED2.1 30.23,42.42 29.34,41.53 R6.1

## Copper pours and planes (outline as drawn; the poured copper is in the pictures)
GND on Top Layer: -1.14,47.62 64.9,47.62 64.9,-0.76 -1.14,-0.76
GND on Bottom Layer: -3.17,49.28 65.28,49.28 65.28,-2.92 -3.17,-2.92
VDD_M on Top Layer: 7.62,6.98 9.91,9.27 17.27,9.27 18.54,10.54 18.54,12.95 19.43,13.84 24.13,13.84 25.02,12.95 25.02,4.45 24.13,3.56 8.26,3.56 7.62,4.19

## Text on the board
Top Silkscreen Layer: SIGNAL IN | 24V OUT | GND | SIGNAL OUT | VCCL | 24V IN | VCCH

# Board PCB2
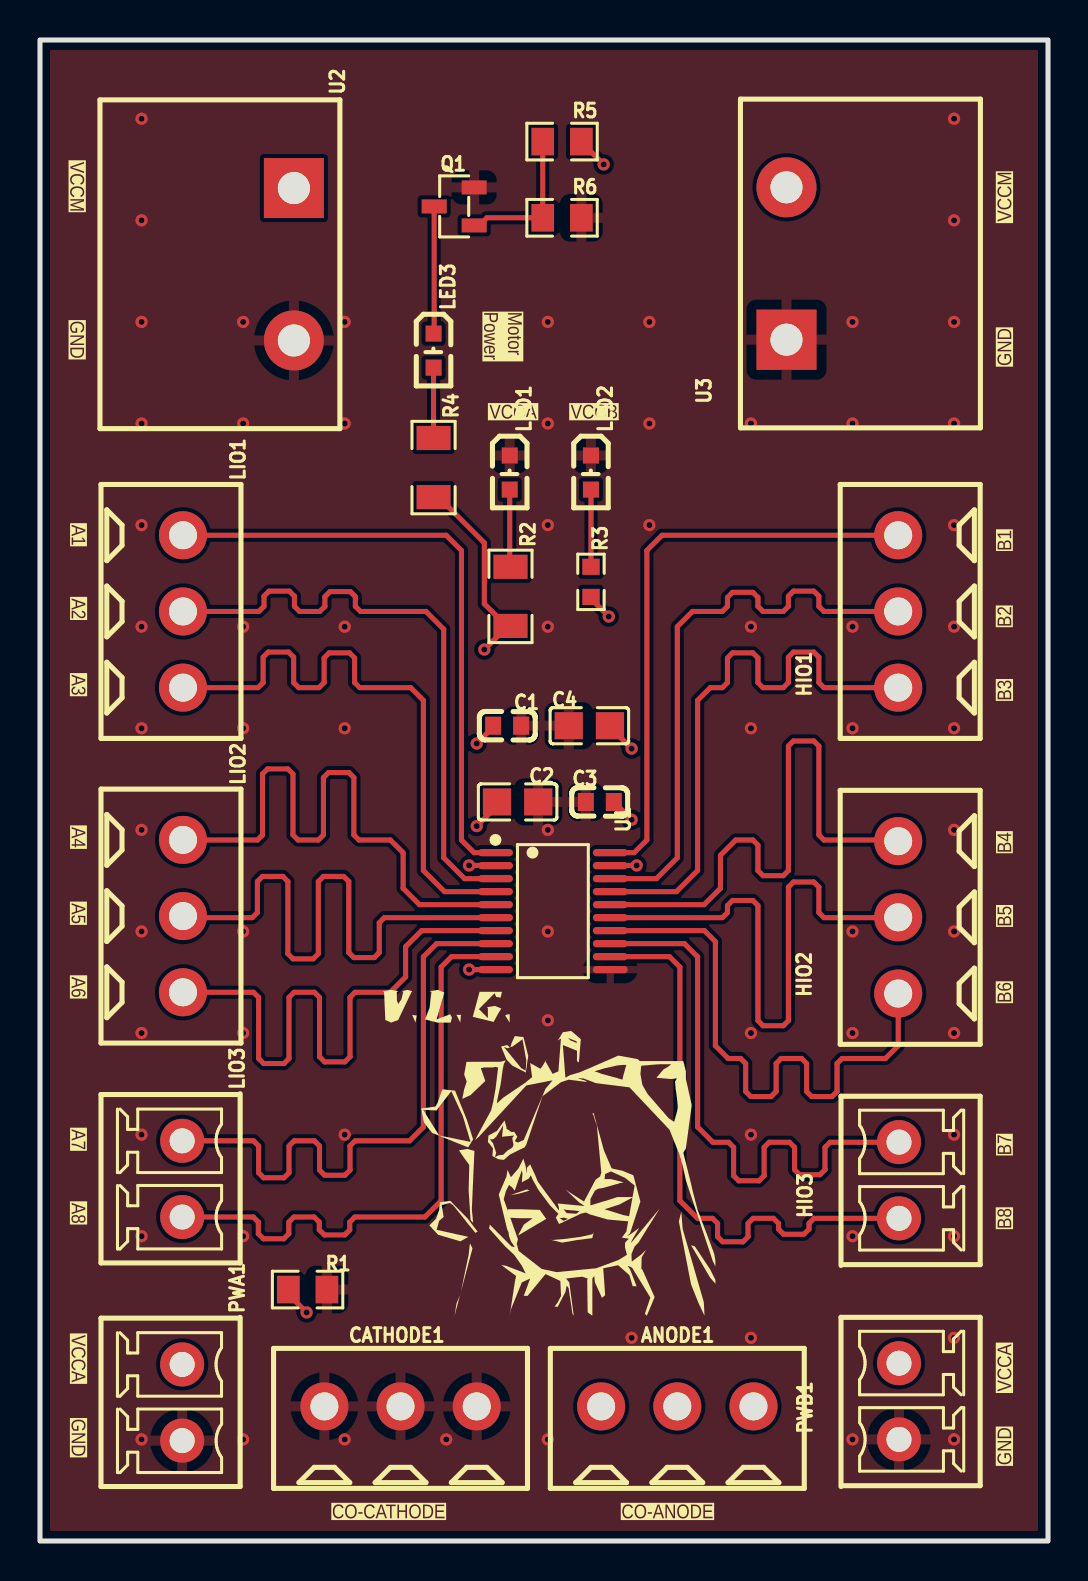
[diagram p4: board, top side]
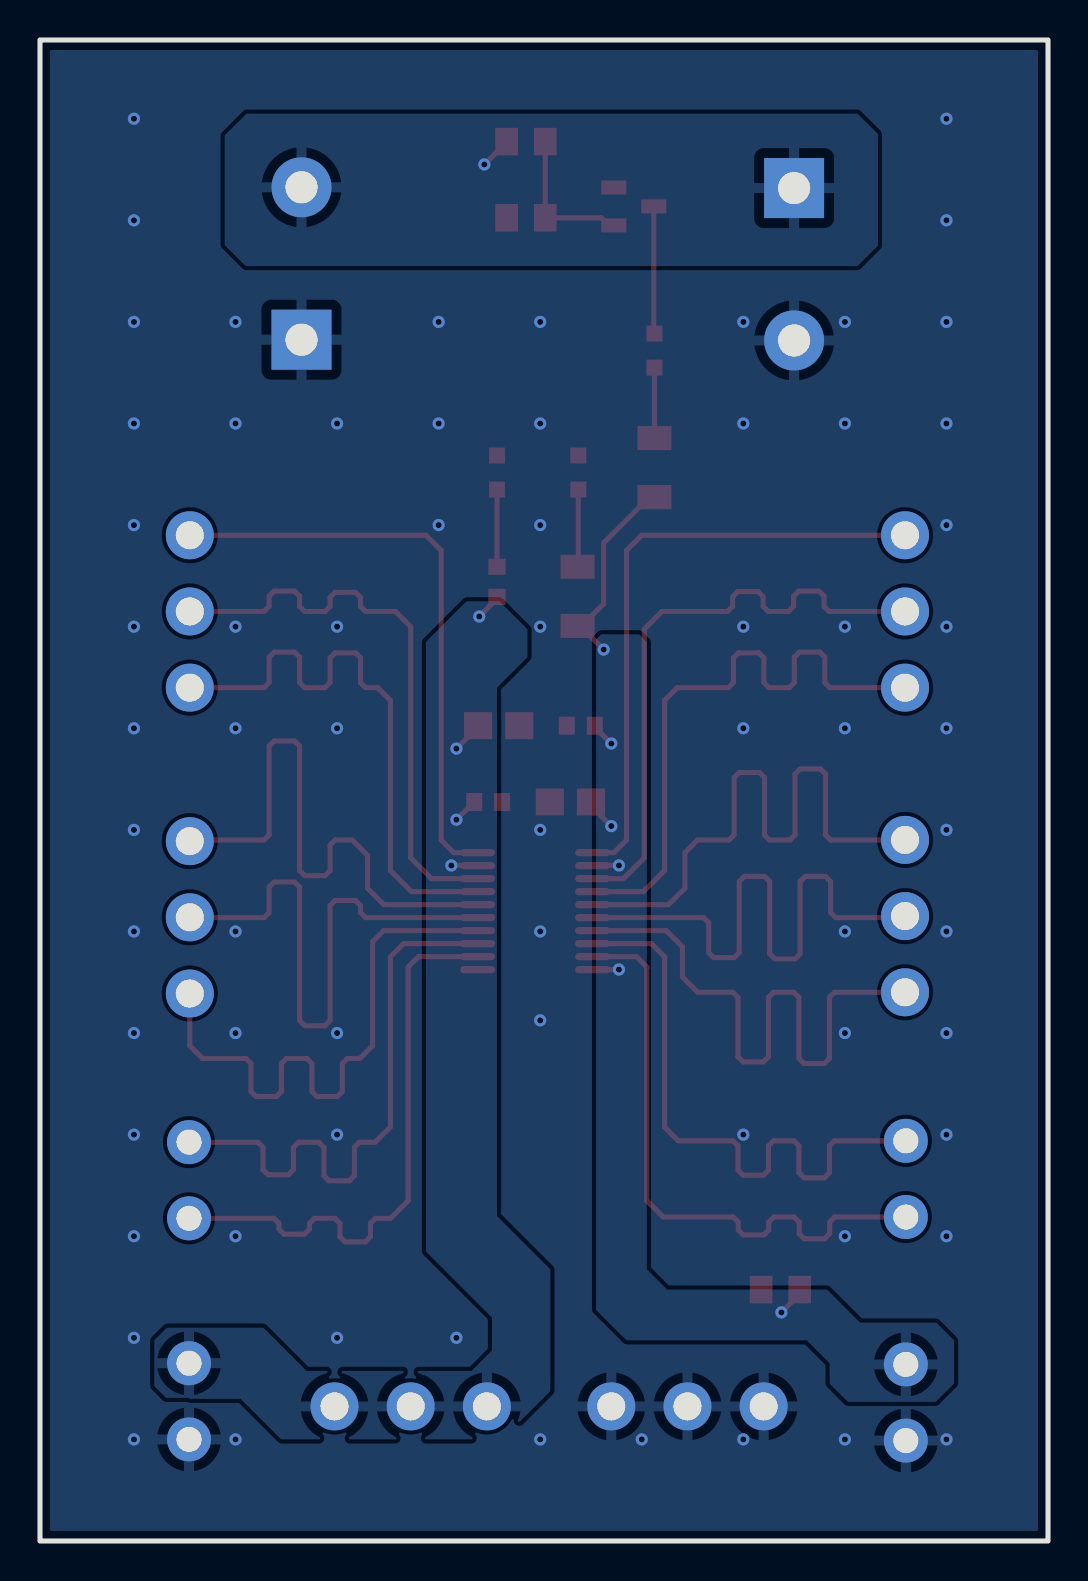
[diagram p5: board, bottom side, seen from below]

Outline 50.42 x 75.06 mm; copper layers: Top Layer, Bottom Layer. Coordinates in mm from the lower left corner of the outline.
Outline path: rectangle 0,75.06 50.42,0
Stack: Top Layer 0.035mm / Dielectric1 1.51mm FR4 er 4.5 / Bottom Layer 0.035mm

## Design rules (mm)
spacing safeClearance (default): track to track 0.152, other pairs 0.152 to 0.3
track width trackWidth (default): min 0.127, default 0.254, max 2.54
differential pair differentialPair (default): width min 0.127, default 0.254, max 2.54; gap min 0.152, default 0.152
via viaSize (default): diameter min 0.5, default 0.61, max 10; hole min 0.3, default 0.305, max 6

## Placement (name value [footprint] x y rotation side)
ANODE1  WJ15EDGVC-3.81-3P  [CONN-TH_3P-P3.81_WJ15EDGVC-3.81-3P]  31.88 6.73 0 top
C1  100nF  [C0603]  23.37 40.77 180 top
C2  4.7uF  [C0805]  23.89 36.96 180 top
C3  100nF  [C0603]  28 36.95 0 top
C4  4.7uF  [C0805]  27.48 40.77 0 top
CATHODE1  WJ15EDGVC-3.81-3P  [CONN-TH_3P-P3.81_WJ15EDGVC-3.81-3P]  18.03 6.73 0 top
HIO1  WJ15EDGVC-3.81-3P  [CONN-TH_3P-P3.81_WJ15EDGVC-3.81-3P]  42.93 46.48 90 top
HIO2  WJ15EDGVC-3.81-3P  [CONN-TH_3P-P3.81_WJ15EDGVC-3.81-3P]  42.93 31.19 90 top
HIO3  WJ15EDGVC-3.81-2P  [CONN-TH_WJ15EDGVC-3.81-2P]  42.97 18.04 90 top
LED1  19-217/R6C-AL1M2VY/3T  [LED0603-R-RD]  23.5 53.43 270 top
LED2  19-217/BHC-ZL1M2RY/3T  [LED0603-R-RD_BLUE]  27.56 53.43 270 top
LED3  19-217/R6C-AL1M2VY/3T  [LED0603-R-RD]  19.69 59.52 270 top
LIO1  WJ15EDGVC-3.81-3P  [CONN-TH_3P-P3.81_WJ15EDGVC-3.81-3P]  7.15 46.48 270 top
LIO2  WJ15EDGVC-3.81-3P  [CONN-TH_3P-P3.81_WJ15EDGVC-3.81-3P]  7.15 31.25 270 top
LIO3  WJ15EDGVC-3.81-2P  [CONN-TH_WJ15EDGVC-3.81-2P]  7.11 18.11 270 top
PWA1  WJ15EDGVC-3.81-2P  [CONN-TH_WJ15EDGVC-3.81-2P]  7.11 6.92 270 top
PWB1  WJ15EDGVC-3.81-2P  [CONN-TH_WJ15EDGVC-3.81-2P]  42.97 6.98 90 top
Q1  2N7002  [SOT-23-3_L2.9-W1.3-P1.90-LS2.4-BR]  20.72 66.74 0 top
R1  50kΩ  [R0805]  13.38 12.57 180 top
R2  470Ω  [R1206]  23.53 47.24 270 top
R3  330Ω  [R0603]  27.56 47.96 270 top
R4  470Ω  [R1206]  19.69 53.68 270 top
R5  50kΩ  [R0805]  26.11 69.98 0 top
R6  50kΩ  [R0805]  26.11 66.17 180 top
U1  TXB0108PWR  [TSSOP-20_L6.5-W4.4-P0.65-LS6.4-BL]  25.65 31.5 270 top
U2  KF7.62-2P  [CONN-TH_KF7.62-2P]  12.7 63.84 270 top
U3  KF7.62-2P  [CONN-TH_KF7.62-2P]  37.34 63.88 90 top

## Footprints (pads in the part's own frame, mm; a bottom-side part is the same pattern mirrored in y, then rotated)
C0603
  rect 0.8x0.9 smd: 1(-0.7,0) 2(0.7,0)
C0805
  rect 1.41x1.35 smd: 1(-1.03,0) 2(1.03,0)
CONN-TH_3P-P3.81_WJ15EDGVC-3.81-3P
  round 2.401 hole 1.399: 1(-3.81,0) 2(0,0) 3(3.81,0)
CONN-TH_KF7.62-2P
  rect 2.999x2.999 hole 1.6: 1(-3.81,0)
  round 2.999 hole 1.6: 2(3.81,0)
CONN-TH_WJ15EDGVC-3.81-2P
  round 2.2 hole 1.25: 1(-1.905,0) 2(1.905,0)
LED0603-R-RD
  rect 0.8x0.8 smd: 1(0.851,0) 2(-0.851,0)
LED0603-R-RD_BLUE
  rect 0.8x0.8 smd: 1(0.851,0) 2(-0.851,0)
R0603
  rect 0.806x0.864 smd: 1(-0.753,0) 2(0.753,0)
R0805
  rect 1.133x1.377 smd: 1(-0.966,0) 2(0.966,0)
R1206
  rect 1.208x1.701 smd: 1(-1.479,0) 2(1.479,0)
SOT-23-3_L2.9-W1.3-P1.90-LS2.4-BR
  rect 1.25x0.7 smd: 1(1,-0.95) 2(1,0.95) 3(-1,0)
TSSOP-20_L6.5-W4.4-P0.65-LS6.4-BL
  oval 0.364x1.742 smd: 1(-2.925,-2.871) 2(-2.275,-2.871) 3(-1.625,-2.871) 4(-0.975,-2.871) 5(-0.325,-2.871) 6(0.325,-2.871) 7(0.975,-2.871) 8(1.625,-2.871) 9(2.275,-2.871) 10(2.925,-2.871) 11(2.925,2.871) 12(2.275,2.871) 13(1.625,2.871) 14(0.975,2.871) 15(0.325,2.871) 16(-0.325,2.871) 17(-0.975,2.871) 18(-1.625,2.871) 19(-2.275,2.871) 20(-2.925,2.871)

## Nets
As in the schematic.

## Via types
v1: diameter 0.61, hole 0.305, Top Layer to Bottom Layer, 79 vias

## Routing (per net, layer and track width the routed paths; a pad name or vN(x,y) marks a point on that pad's centre or on a via; arc(x,y) is an arc through that point)
GND:
  vias: v1(5.08,71.12) v1(5.08,66.04) v1(5.08,60.96) v1(5.08,55.88) v1(5.08,50.8) v1(5.08,45.72) v1(5.08,40.64) v1(5.08,35.56) v1(5.08,30.48) v1(5.08,25.4) v1(5.08,20.32) v1(5.08,15.24) v1(5.08,5.08) v1(10.16,60.96) v1(10.16,55.88) v1(10.16,45.72) v1(10.16,40.64) v1(10.16,30.48) v1(10.16,25.4) v1(10.16,15.24) v1(10.16,5.08) v1(15.24,60.96) v1(15.24,55.88) v1(15.24,45.72) v1(15.24,40.64) v1(15.24,20.32) v1(15.24,5.08) v1(20.32,5.08) v1(25.4,60.96) v1(25.4,55.88) v1(25.4,50.8) v1(25.4,45.72) v1(25.4,35.56) v1(25.4,30.48) v1(25.4,26.03) v1(25.4,5.08) v1(29.59,10.16) v1(30.48,60.96) v1(30.48,55.88) v1(30.48,50.8) v1(35.56,55.88) v1(35.56,45.72) v1(35.56,40.64) v1(35.56,25.4) v1(35.56,20.32) v1(35.56,10.16) v1(40.64,60.96) v1(40.64,55.88) v1(40.64,45.72) v1(40.64,40.64) v1(40.64,30.48) v1(40.64,25.4) v1(40.64,15.24) v1(40.64,5.08) v1(45.72,71.12) v1(45.72,66.04) v1(45.72,60.96) v1(45.72,55.88) v1(45.72,50.8) v1(45.72,45.72) v1(45.72,40.64) v1(45.72,35.56) v1(45.72,30.48) v1(45.72,25.4) v1(45.72,20.32) v1(45.72,15.24) v1(45.72,10.16) v1(45.72,5.08)
VCCA: length 17
  Top Layer w0.254: v1(21.84,39.88) 22.67,40.7 C1.2 ; U1.2 22.77,33.78 v1(21.46,33.78) ; 23.41,45.76 23.33,45.76 22.22,46.86 22.22,49.91 19.94,52.2 R4.2 ; 23.41,45.76 R2.2 ; 23.41,45.76 v1(22.22,44.58) ; v1(21.46,28.57) 21.47,28.57 U1.10 ; v1(21.84,35.75) 22.86,36.76 C2.2 ; v1(13.34,11.43) 12.42,12.35 R1.2
VCCB: length 5.5
  Top Layer w0.254: v1(29.59,36.07) 28.7,36.95 C3.2 ; 27.56,47.21 27.56,47.12 v1(28.45,46.23) ; U1.19 28.54,33.78 v1(29.84,33.78) ; v1(29.59,39.62) 28.51,40.71 C4.2
VCCM: length 1.6
  Top Layer w0.254: R5.2 27.08,69.95 v1(28.19,68.83)
A1: length 30.7
  Top Layer w0.254: LIO1.1 20.32,50.29 21.08,49.53 21.08,35.05 21.71,34.42 U1.1
A2: length 30.7
  Top Layer w0.254: U1.3 21.24,33.12 20.19,34.16 20.19,45.59 19.3,46.48 16.03,46.48 15.77,46.74 15.77,47.22 15.52,47.47 14.5,47.47 14.25,47.22 14.25,46.74 14,46.48 12.98,46.48 12.73,46.74 12.73,47.24 12.47,47.5 11.46,47.5 11.2,47.24 11.2,46.74 10.95,46.48 LIO1.2
A3: length 30.7
  Top Layer w0.254: U1.4 20.23,32.47 19.18,33.53 19.18,42.04 18.54,42.67 15.99,42.67 15.74,42.93 15.74,44.16 15.48,44.41 14.47,44.41 14.21,44.16 14.21,42.93 13.96,42.67 12.94,42.67 12.69,42.93 12.69,44.2 12.43,44.45 11.42,44.45 11.16,44.2 11.16,42.93 10.91,42.67 LIO1.3
A4: length 30.7
  Top Layer w0.254: U1.5 18.98,31.82 18.16,32.64 18.16,34.42 17.53,35.05 15.96,35.05 15.7,35.31 15.7,38.17 15.45,38.43 14.43,38.43 14.18,38.17 14.18,35.31 13.92,35.05 12.91,35.05 12.65,35.31 12.65,38.35 12.4,38.61 11.38,38.61 11.13,38.35 11.13,35.31 10.88,35.05 7.16,35.05 LIO2.1
A5: length 30.5
  Top Layer w0.254: LIO2.2 7.23,31.17 10.62,31.17 10.87,31.42 10.87,32.98 11.13,33.23 12.14,33.23 12.4,32.98 12.4,29.36 12.65,29.11 13.67,29.11 13.92,29.36 13.92,32.98 14.18,33.23 15.19,33.23 15.45,32.98 15.45,29.43 15.7,29.17 16.72,29.17 16.97,29.43 16.97,30.92 17.22,31.17 U1.6
A6: length 30.7
  Top Layer w0.254: U1.7 19.09,30.52 18.29,29.72 18.29,28.21 17.52,27.44 15.76,27.44 15.51,27.18 15.51,24.21 15.25,23.96 14.24,23.96 13.98,24.21 13.98,27.18 13.73,27.44 12.71,27.44 12.46,27.18 12.46,24.13 12.2,23.88 11.19,23.88 10.93,24.13 10.93,27.18 10.68,27.44 LIO2.3
A7: length 30.7
  Top Layer w0.254: U1.8 19.84,29.87 19.18,29.21 19.18,20.7 18.49,20.01 15.76,20.01 15.51,19.76 15.51,18.55 15.25,18.29 14.24,18.29 13.98,18.55 13.98,19.76 13.73,20.01 12.71,20.01 12.46,19.76 12.46,18.41 12.2,18.16 11.19,18.16 10.93,18.41 10.93,19.76 10.68,20.01 LIO3.1
A8: length 30.7
  Top Layer w0.254: LIO3.2 10.67,16.2 10.92,15.95 10.92,15.37 11.18,15.11 12.19,15.11 12.45,15.37 12.45,15.95 12.7,16.2 13.72,16.2 13.97,15.95 13.97,15.56 14.22,15.3 15.24,15.3 15.49,15.56 15.49,15.95 15.75,16.2 19.25,16.2 20.07,17.02 20.07,28.7 20.59,29.22 U1.9
B1: length 29.5
  Top Layer w0.254: HIO1.3 31.12,50.29 30.35,49.53 30.35,35.05 29.72,34.42 U1.20
B2: length 29.5
  Top Layer w0.254: U1.18 30.84,33.12 31.88,34.16 31.88,45.72 32.64,46.48 34.13,46.48 34.39,46.74 34.39,47.18 34.64,47.44 35.66,47.44 35.91,47.18 35.91,46.74 36.16,46.48 37.18,46.48 37.43,46.74 37.43,47.24 37.69,47.5 38.7,47.5 38.96,47.24 38.96,46.74 39.21,46.48 HIO1.2
B3: length 29.5
  Top Layer w0.254: U1.17 31.84,32.47 32.89,33.53 32.89,42.04 33.53,42.67 34.13,42.67 34.39,42.93 34.39,44.16 34.64,44.41 35.66,44.41 35.91,44.16 35.91,42.93 36.16,42.67 37.18,42.67 37.43,42.93 37.43,44.2 37.69,44.45 38.7,44.45 38.96,44.2 38.96,42.93 39.21,42.67 HIO1.1
B4: length 29.3
  Top Layer w0.254: U1.16 33.22,31.82 34.04,32.64 34.04,34.29 34.8,35.05 35.66,35.05 35.91,34.8 35.91,33.52 36.16,33.27 37.18,33.27 37.43,33.52 37.43,39.75 37.69,40 38.7,40 38.96,39.75 38.96,35.31 39.21,35.05 42.87,35.05 HIO2.3
B5: length 29.3
  Top Layer w0.254: HIO2.2 42.91,31.17 39.21,31.17 38.96,31.42 38.96,32.7 38.7,32.95 37.69,32.95 37.43,32.7 37.43,26.02 37.18,25.77 36.16,25.77 35.91,26.02 35.91,31.78 35.66,32.03 34.64,32.03 34.39,31.78 34.39,31.42 34.13,31.17 U1.15
B6: length 29.4
  Top Layer w0.254: U1.14 33.23,30.52 33.78,29.97 33.78,24.76 34.42,24.13 35.04,24.13 35.3,23.88 35.3,22.48 35.55,22.22 36.57,22.22 36.82,22.48 36.82,23.88 37.07,24.13 38.09,24.13 38.34,23.88 38.34,22.48 38.6,22.22 39.61,22.22 39.87,22.48 39.87,23.88 40.12,24.13 42.29,24.13 42.93,24.76 HIO2.1
B7: length 29.5
  Top Layer w0.254: U1.13 32.23,29.87 32.89,29.21 32.89,20.7 33.66,19.94 34.44,19.94 34.69,19.68 34.69,18.26 34.95,18.01 35.96,18.01 36.22,18.26 36.22,19.68 36.47,19.94 37.49,19.94 37.74,19.68 37.74,18.57 38,18.31 39.01,18.31 39.27,18.57 39.27,19.68 39.52,19.94 42.96,19.94 HIO3.2
B8: length 29.5
  Top Layer w0.254: HIO3.1 38.72,16.14 38.46,15.88 38.46,15.59 38.21,15.34 37.19,15.34 36.94,15.59 36.94,15.88 36.69,16.14 35.67,16.14 35.42,15.88 35.42,15.21 35.16,14.96 34.15,14.96 33.89,15.21 33.89,15.88 33.64,16.14 32.89,16.14 32,17.02 32,28.7 31.49,29.22 U1.12
$1N1712: length 3.9
  Top Layer w0.254: LED1.1 23.5,48.75 R2.1
$1N1958: length 3.9
  Top Layer w0.254: LED2.1 R3.1
$1N11307: length 3.5
  Top Layer w0.254: R4.1 LED3.1
$1N13493: length 6.4
  Top Layer w0.254: Q1.3 19.72,60.41 LED3.2
$1N13938: length 7.4
  Top Layer w0.254: Q1.1 21.97,65.79 22.35,66.17 R6.2 R5.1

## Copper pours and planes (outline as drawn; the poured copper is in the pictures)
GND on Top Layer: 0,75.06 50.42,75.06 50.42,0 0,0
GND on Top Layer: 0,75.06 50.42,75.06 50.42,0 0,0
GND on Top Layer: 32.89,36.24 38.61,36.24 38.61,24.89 32.89,24.89
GND on Bottom Layer: 0,75.06 50.42,75.06 50.42,0 0,0
VCCA on Bottom Layer: 22.35,45.34 22.61,45.08 22.61,11.56 21.08,10.03 12.06,10.03 10.92,8.89 10.92,7.86 10.01,6.95 5.62,6.95 4.7,7.87 4.7,10.03 5.59,10.92 9.4,10.92 11.05,12.57 19.05,12.57 20.07,13.59 20.07,44.96 20.45,45.34
VCCB on Bottom Layer: 42.97,7.16 44.11,7.16 44.7,7.75 44.7,10.03 44.07,10.67 39.24,10.67 37.08,8.51 28.83,8.51 27.81,9.52 27.81,11.18 31.12,14.48 31.12,44.96 29.08,46.99 27.43,46.99 26.03,45.59 26.03,44.2 27.56,42.67 27.56,16.26 24.89,13.59 24.89,7.49 27.31,5.08 38.35,5.08 40.39,7.11 42.92,7.11
VCCM on Bottom Layer: 8.51,70.36 9.53,71.37 40.09,71.37 41.18,70.28 41.18,64.81 40.13,63.75 9.53,63.75 8.51,64.77

## Text on the board
Top Silkscreen Layer: VCCA | VCCB | VCCM | GND | A1 | A2 | A3 | A4 | A5 | A6 | A7 | A8 | Motor / Power | CO-CATHODE | CO-ANODE | B1 | B2 | B3 | B4 | B5 | B6 | B7 | B8
